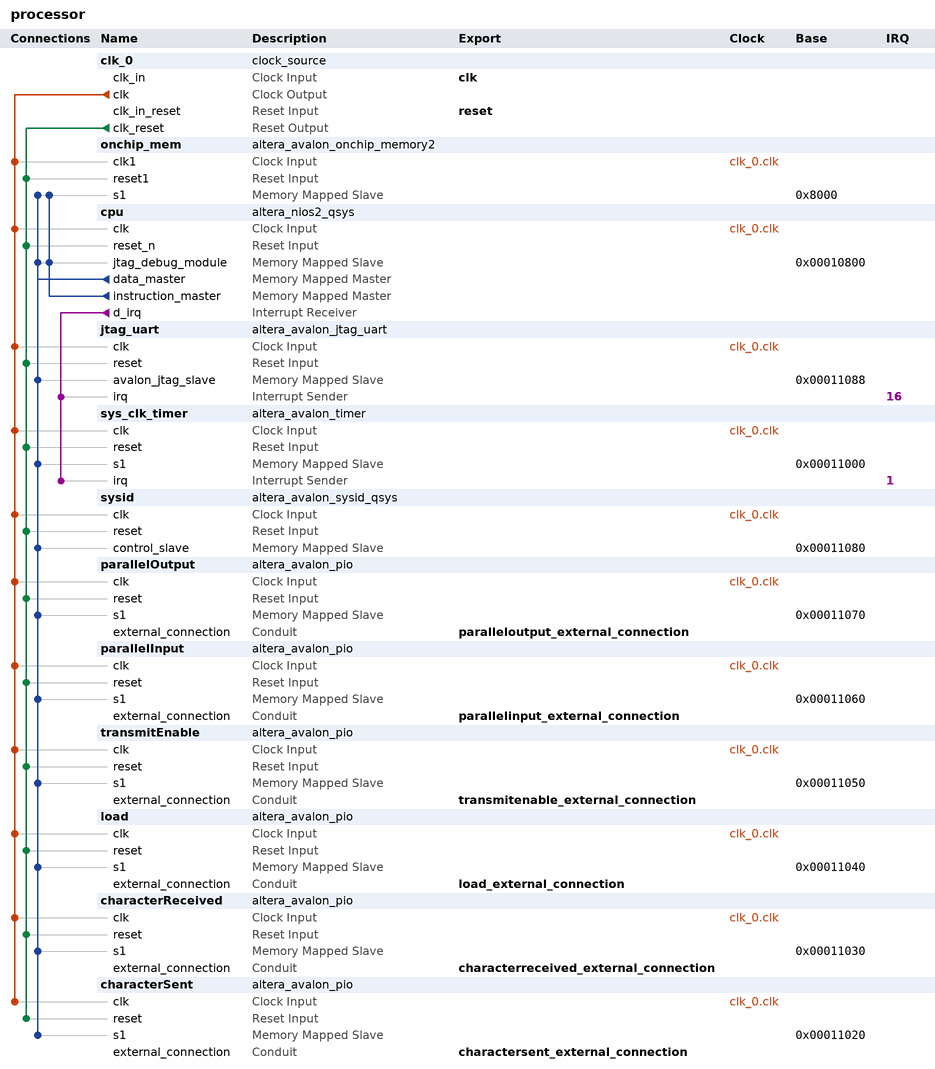
[diagram p0: system contents]
# Platform Designer (Qsys) system processor, Cyclone V 5CSEMA5F31C6
# Parameters at their usual value, and those the tool derives, are not listed.
package require -exact qsys 17.1
create_system processor
set_project_property DEVICE_FAMILY {Cyclone V}
set_project_property DEVICE 5CSEMA5F31C6

add_instance clk_0 clock_source 17.1
set_instance_parameter_value clk_0 clockFrequency 50000000

add_instance onchip_mem altera_avalon_onchip_memory2 17.1
set_instance_parameter_value onchip_mem dataWidth 32
set_instance_parameter_value onchip_mem dualPort false
set_instance_parameter_value onchip_mem initMemContent true
set_instance_parameter_value onchip_mem initializationFileName onchip_mem.hex
set_instance_parameter_value onchip_mem memorySize 20480

add_instance cpu altera_nios2_qsys 16.1
set_instance_parameter_value cpu breakSlave cpu.jtag_debug_module
set_instance_parameter_value cpu exceptionSlave onchip_mem.s1
set_instance_parameter_value cpu icache_size 2048
set_instance_parameter_value cpu impl Small
set_instance_parameter_value cpu mmu_TLBMissExcSlave None
set_instance_parameter_value cpu muldiv_multiplierType NoneSmall
set_instance_parameter_value cpu resetSlave onchip_mem.s1
set_instance_parameter_value cpu resetrequest_enabled true

add_instance jtag_uart altera_avalon_jtag_uart 17.1
set_instance_parameter_value jtag_uart simInteractiveOptions NO_INTERACTIVE_WINDOWS

add_instance sys_clk_timer altera_avalon_timer 17.1
set_instance_parameter_value sys_clk_timer period 1
set_instance_parameter_value sys_clk_timer periodUnits MSEC

add_instance sysid altera_avalon_sysid_qsys 17.1
set_instance_parameter_value sysid id 0

add_instance parallelOutput altera_avalon_pio 17.1
set_instance_parameter_value parallelOutput direction Output
set_instance_parameter_value parallelOutput resetValue 255
set_instance_parameter_value parallelOutput width 8

add_instance parallelInput altera_avalon_pio 17.1
set_instance_parameter_value parallelInput direction Input
set_instance_parameter_value parallelInput width 8

add_instance transmitEnable altera_avalon_pio 17.1
set_instance_parameter_value transmitEnable direction Output
set_instance_parameter_value transmitEnable width 1

add_instance load altera_avalon_pio 17.1
set_instance_parameter_value load direction Output
set_instance_parameter_value load width 1

add_instance characterReceived altera_avalon_pio 17.1
set_instance_parameter_value characterReceived direction Input
set_instance_parameter_value characterReceived width 1

add_instance characterSent altera_avalon_pio 17.1
set_instance_parameter_value characterSent direction Input
set_instance_parameter_value characterSent width 1

# connections
add_connection clk_0.clk characterReceived.clk clock
add_connection clk_0.clk characterSent.clk clock
add_connection clk_0.clk cpu.clk clock
add_connection clk_0.clk jtag_uart.clk clock
add_connection clk_0.clk load.clk clock
add_connection clk_0.clk onchip_mem.clk1 clock
add_connection clk_0.clk parallelInput.clk clock
add_connection clk_0.clk parallelOutput.clk clock
add_connection clk_0.clk sys_clk_timer.clk clock
add_connection clk_0.clk sysid.clk clock
add_connection clk_0.clk transmitEnable.clk clock
add_connection clk_0.clk_reset characterReceived.reset reset
add_connection clk_0.clk_reset characterSent.reset reset
add_connection clk_0.clk_reset cpu.reset_n reset
add_connection clk_0.clk_reset jtag_uart.reset reset
add_connection clk_0.clk_reset load.reset reset
add_connection clk_0.clk_reset onchip_mem.reset1 reset
add_connection clk_0.clk_reset parallelInput.reset reset
add_connection clk_0.clk_reset parallelOutput.reset reset
add_connection clk_0.clk_reset sys_clk_timer.reset reset
add_connection clk_0.clk_reset sysid.reset reset
add_connection clk_0.clk_reset transmitEnable.reset reset
add_connection cpu.data_master characterReceived.s1 avalon
set_connection_parameter_value cpu.data_master/characterReceived.s1 baseAddress 0x00011030
add_connection cpu.data_master characterSent.s1 avalon
set_connection_parameter_value cpu.data_master/characterSent.s1 baseAddress 0x00011020
add_connection cpu.data_master cpu.jtag_debug_module avalon
set_connection_parameter_value cpu.data_master/cpu.jtag_debug_module baseAddress 0x00010800
add_connection cpu.data_master jtag_uart.avalon_jtag_slave avalon
set_connection_parameter_value cpu.data_master/jtag_uart.avalon_jtag_slave baseAddress 0x00011088
add_connection cpu.data_master load.s1 avalon
set_connection_parameter_value cpu.data_master/load.s1 baseAddress 0x00011040
add_connection cpu.data_master onchip_mem.s1 avalon
set_connection_parameter_value cpu.data_master/onchip_mem.s1 baseAddress 0x8000
add_connection cpu.data_master parallelInput.s1 avalon
set_connection_parameter_value cpu.data_master/parallelInput.s1 baseAddress 0x00011060
add_connection cpu.data_master parallelOutput.s1 avalon
set_connection_parameter_value cpu.data_master/parallelOutput.s1 baseAddress 0x00011070
add_connection cpu.data_master sys_clk_timer.s1 avalon
set_connection_parameter_value cpu.data_master/sys_clk_timer.s1 baseAddress 0x00011000
add_connection cpu.data_master sysid.control_slave avalon
set_connection_parameter_value cpu.data_master/sysid.control_slave baseAddress 0x00011080
add_connection cpu.data_master transmitEnable.s1 avalon
set_connection_parameter_value cpu.data_master/transmitEnable.s1 baseAddress 0x00011050
add_connection cpu.instruction_master cpu.jtag_debug_module avalon
set_connection_parameter_value cpu.instruction_master/cpu.jtag_debug_module baseAddress 0x00010800
add_connection cpu.instruction_master onchip_mem.s1 avalon
set_connection_parameter_value cpu.instruction_master/onchip_mem.s1 baseAddress 0x8000
add_connection cpu.d_irq jtag_uart.irq interrupt
set_connection_parameter_value cpu.d_irq/jtag_uart.irq irqNumber 16
add_connection cpu.d_irq sys_clk_timer.irq interrupt
set_connection_parameter_value cpu.d_irq/sys_clk_timer.irq irqNumber 1

# exported interfaces
add_interface characterreceived_external_connection conduit end
set_interface_property characterreceived_external_connection EXPORT_OF characterReceived.external_connection
add_interface charactersent_external_connection conduit end
set_interface_property charactersent_external_connection EXPORT_OF characterSent.external_connection
add_interface clk clock sink
set_interface_property clk EXPORT_OF clk_0.clk_in
add_interface load_external_connection conduit end
set_interface_property load_external_connection EXPORT_OF load.external_connection
add_interface parallelinput_external_connection conduit end
set_interface_property parallelinput_external_connection EXPORT_OF parallelInput.external_connection
add_interface paralleloutput_external_connection conduit end
set_interface_property paralleloutput_external_connection EXPORT_OF parallelOutput.external_connection
add_interface reset reset sink
set_interface_property reset EXPORT_OF clk_0.clk_in_reset
add_interface transmitenable_external_connection conduit end
set_interface_property transmitenable_external_connection EXPORT_OF transmitEnable.external_connection

set_interconnect_requirement {$system} qsys_mm.clockCrossingAdapter HANDSHAKE
set_interconnect_requirement {$system} qsys_mm.enableEccProtection FALSE
set_interconnect_requirement {$system} qsys_mm.insertDefaultSlave FALSE
set_interconnect_requirement {$system} qsys_mm.maxAdditionalLatency 1

save_system processor.qsys
